# Altium schematic sheet ECG_AFE_AD8832.SchDoc
size A; SheetNumber: 2; SheetTotal: 5
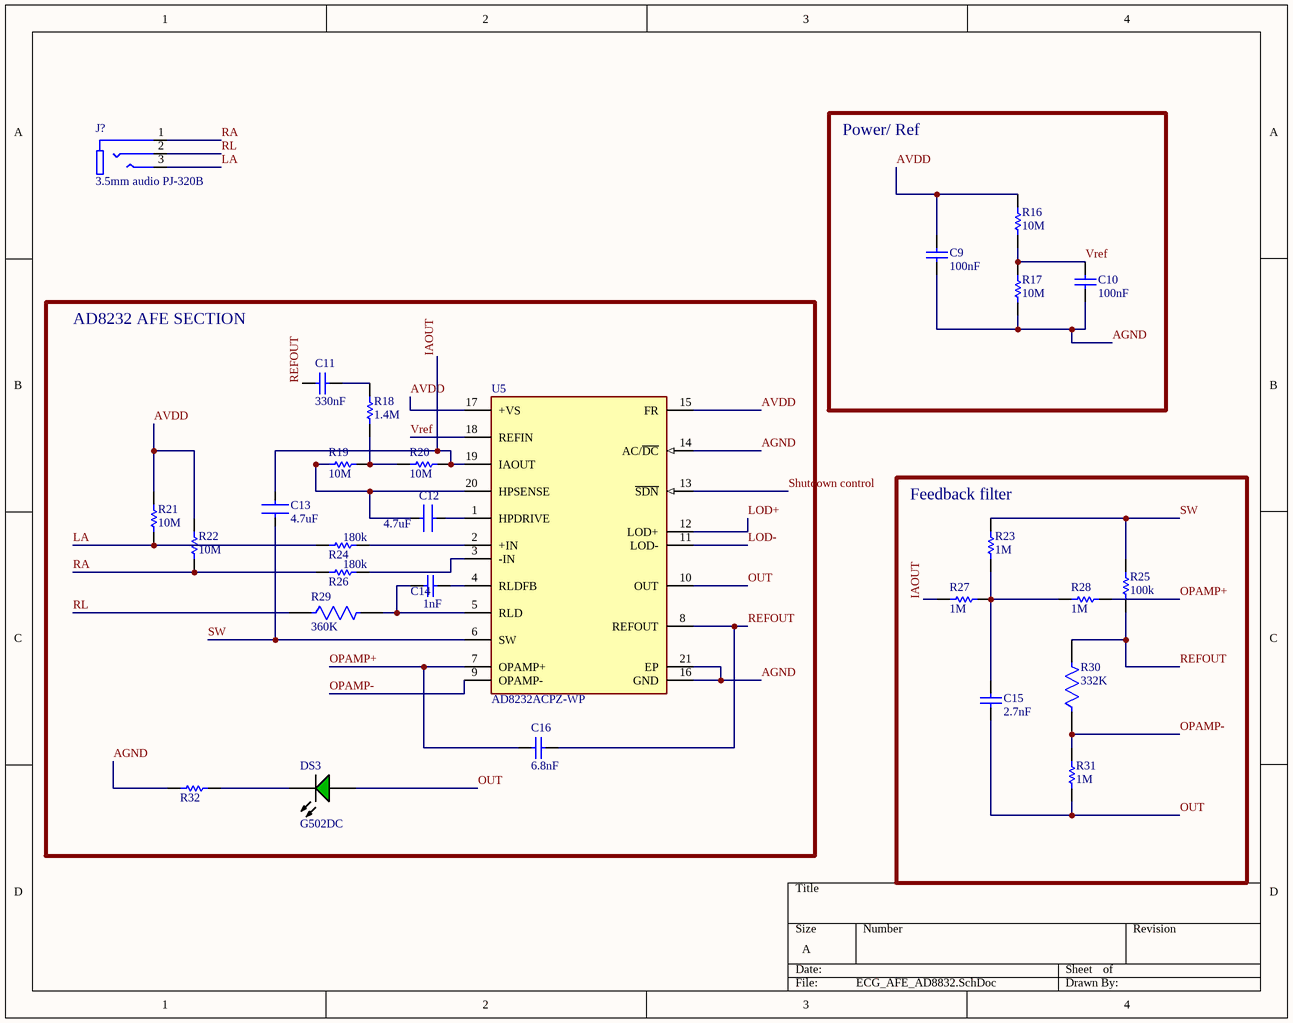
[diagram p0: ECG_AFE_AD8832.SchDoc]

## Parts
C9  100nF  [CAP-0603-IPC_B]
C10  100nF  [CAP-0603-IPC_B]
C11  330nF  [CAP-0603-IPC_B]
C12  4.7uF  [CAP-0805-IPC_B]
C13  4.7uF  [CAP-0805-IPC_B]
C14  1nF  [CAP-0603-IPC_B]
C15  2.7nF  [CAP-0603-IPC_B]
C16  6.8nF  [CAP-0603-IPC_B]
DS3  G502DC  [CGX-G502DC]
J?  3.5mm audio PJ-320B  [3.5mm Audio PJ-320B]
R16  10M  [RES-0603-IPC_B]
R17  10M  [RES-0603-IPC_B]
R18  1.4M  [RES-0603-IPC_B]
R19  10M  [RES-0603-IPC_B]
R20  10M  [RES-0603-IPC_B]
R21  10M  [RES-0603-IPC_B]
R22  10M  [RES-0603-IPC_B]
R23  1M  [RES-0603-IPC_B]
R24  180k  [RES-0603-IPC_B]
R25  100k  [RES-0603-IPC_B]
R26  180k  [RES-0603-IPC_B]
R27  1M  [RES-0603-IPC_B]
R28  1M  [RES-0603-IPC_B]
R29  360K  [RES 0805 Medium]
R30  332K  [RES 0805 Medium]
R31  1M  [RES-0603-IPC_B]
R32  1.5k RES-0603-IPC-B_2  [RES-0603-IPC_B]  (value not drawn)
U5  AD8232ACPZ-WP  [FP-CP-20-8-IPC_A]

## Blocks framed on the sheet
Power/ Ref: C9 C10 R16 R17
AD8232 AFE SECTION: C11-C14 C16 DS3 R18-R22 R24 R26 R29 R32 U5
Feedback filter: C15 R23 R25 R27 R28 R30 R31

## Nets
AGND: C9.1 C10.1 R17.1 R32.1 U5.14(AC/~{DC}) U5.16(GND) U5.21(EP)
AVDD: C9.2 R16.2 R21.2 R22.2 U5.15(FR) U5.17(+VS)
IAOUT: C13.2 R20.2 R27.2 U5.19(IAOUT)
LA: J?.3(TIP) R21.1 R24.1
LOD+: U5.12(LOD+)
LOD-: U5.11(LOD-)
OPAMP+: C16.1 R28.2 U5.7(OPAMP+)
OPAMP-: R30.1 R31.2 U5.9(OPAMP-)
OUT: C15.1 DS3.1(A) R31.1 U5.10(OUT)
RA: J?.1(SLEEVE) R22.1 R26.1
REFOUT: C11.1 C16.2 R25.1 R30.2 U5.8(REFOUT)
RL: J?.2(RING) R29.1
Shutdown control: U5.13(~{SDN})
SW: C13.1 R23.2 R25.2 U5.6(SW)
Vref: C10.2 R16.1 R17.2 U5.18(REFIN)
NetC11_2: C11.2 R18.2
NetC12_1: C12.1 U5.1(HPDRIVE)
NetC12_2: C12.2 R19.1 U5.20(HPSENSE)
NetC14_1: C14.1 R29.2 U5.5(RLD)
NetC14_2: C14.2 U5.4(RLDFB)
NetC15_2: C15.2 R23.1 R27.1 R28.1
NetDS3_2: DS3.2(K) R32.2
NetR18_1: R18.1 R19.2 R20.1
NetR24_2: R24.2 U5.2(+IN)
NetR26_2: R26.2 U5.3(-IN)

## Library data of the parts
C9-C11 = 100nF CAP-0603-IPC-B_1: Manufacturer: AVX Interconnect / Elco; Part Number: 0603ZC103MAT2A
C12 C13 = 4.7uF CAP-0805-IPC-B_1
C14 = 1nF CAP-0603-IPC-B_1: Manufacturer: AVX Interconnect / Elco; Part Number: 0603ZC103MAT2A
C15 = 2.7nF CAP-0603-IPC-B_1: Manufacturer: AVX Interconnect / Elco; Part Number: 0603ZC103MAT2A
C16 = 6.8nF CAP-0603-IPC-B_2: Manufacturer: AVX Interconnect / Elco; Part Number: 0603ZC103MAT2A
DS3 = CMP-007-00008-2: Green LED, 80 mW, 20 mA, -25 to 85 degC, 2-Pin THD; Manufacturer: Shenzhen CGX; Mounting Technology: TH; Package Reference: G502DC; Datasheet Version: Sep-14; Manufacturer URL: http://szcgx.com/; Package Description: 2-Pin Through Hole Device, Dia 5.9 mm; Datasheet URL: http://datasheet.octopart.com/G502DC-Chengguangxing-datasheet-62330340.pdf; Case/Package: G502DC; RoHS Compliant: Unknown
J? = 3.5mm audio PJ-320B: ÐŸÐ¾Ñ€Ñ‚ Ð´Ð»Ñ Ð½Ð°ÑƒÑˆÐ½Ð¸ÐºÐ¾Ð²; MF: Luoyang Dishang electronics; SnapEDA_Link: https://www.snapeda.com/parts/PJ-320B/Luoyang%20Dishang%20electronics/view-part/5519978/?ref=snap; Value: *; MP: PJ-320B; Availability: Not in stock; Check_prices: https://www.snapeda.com/parts/PJ-320B/Luoyang%20Dishang%20electronics/view-part/5519978/?ref=eda; Package: Package; Price: None
R16 R17 R19-R22 = 10M RES-0603-IPC-B_4: Max Power Dissipation: 100mW; Temperature Coefficient: 50ppm/°C; Tolerance: 0.5%; Resistance: 4.7kR; Height: 0.022inch; Width: 0.032inch; RoHS Compliant: Yes; Features: Moisture Resistant; Packaging: Tape and Reel; Number of Terminations: 2; Max Operating Temperature: 155°C; Series: AT; Min Operating Temperature: -55°C; Resistor Type: Thin Film; Length: 0.063inch; Case/Package: 0603
R18 R23 R27 R28 R31 = 1M RES-0603-IPC-B_3: Max Power Dissipation: 100mW; Temperature Coefficient: 50ppm/°C; Tolerance: 0.5%; Resistance: 4.7kR; Height: 0.022inch; Width: 0.032inch; RoHS Compliant: Yes; Features: Moisture Resistant; Packaging: Tape and Reel; Number of Terminations: 2; Max Operating Temperature: 155°C; Series: AT; Min Operating Temperature: -55°C; Resistor Type: Thin Film; Length: 0.063inch; Case/Package: 0603
R24 R26 = 180k RES-0603-IPC-B_2: Max Power Dissipation: 100mW; Temperature Coefficient: 50ppm/°C; Tolerance: 0.5%; Resistance: 4.7kR; Height: 0.022inch; Width: 0.032inch; RoHS Compliant: Yes; Features: Moisture Resistant; Packaging: Tape and Reel; Number of Terminations: 2; Max Operating Temperature: 155°C; Series: AT; Min Operating Temperature: -55°C; Resistor Type: Thin Film; Length: 0.063inch; Case/Package: 0603
R25 = 100k RES-0603-IPC-B_1: Max Power Dissipation: 100mW; Temperature Coefficient: 50ppm/°C; Tolerance: 0.5%; Resistance: 4.7kR; Height: 0.022inch; Width: 0.032inch; RoHS Compliant: Yes; Features: Moisture Resistant; Packaging: Tape and Reel; Number of Terminations: 2; Max Operating Temperature: 155°C; Series: AT; Min Operating Temperature: -55°C; Resistor Type: Thin Film; Length: 0.063inch; Case/Package: 0603
R29 = 360K RES-0805-IPC_B_2
R30 = 332K RES-0805-IPC_B_1
R32 = 1.5k RES-0603-IPC-B_2: Max Power Dissipation: 100mW; Temperature Coefficient: 50ppm/°C; Tolerance: 0.5%; Resistance: 4.7kR; Height: 0.022inch; Width: 0.032inch; RoHS Compliant: Yes; Features: Moisture Resistant; Packaging: Tape and Reel; Number of Terminations: 2; Max Operating Temperature: 155°C; Series: AT; Min Operating Temperature: -55°C; Resistor Type: Thin Film; Length: 0.063inch; Case/Package: 0603
U5 = CMP-09085-000022-1: IC ECG FRONT END 20LFCSP; Number of Channels: 1; Input Offset Voltage (Vos): 3mV; Slew Rate: 0.2V/µs; Min Supply Voltage: 2V; Power Supply Rejection Ratio (PSRR): 90dB; Max Supply Voltage: 3.5V; Input Bias Current: 200pA; Operating Supply Current: 170uA; Common Mode Rejection Ratio: 80dB; Gain Bandwidth Product: 100kHz; Packaging: Tray; RoHS Compliant: Yes; Radiation Hardening: No; Contact Plating: Tin; Number of Pins: 20; Width: 4.1mm; REACH SVHC: No SVHC; Mount: Surface Mount; Length: 4.1mm; Lead Free: Contains Lead; Case/Package: LFCSP EP; Min Operating Temperature: -40°C; Max Operating Temperature: 85°C; Height: 0.75mm; Series: -